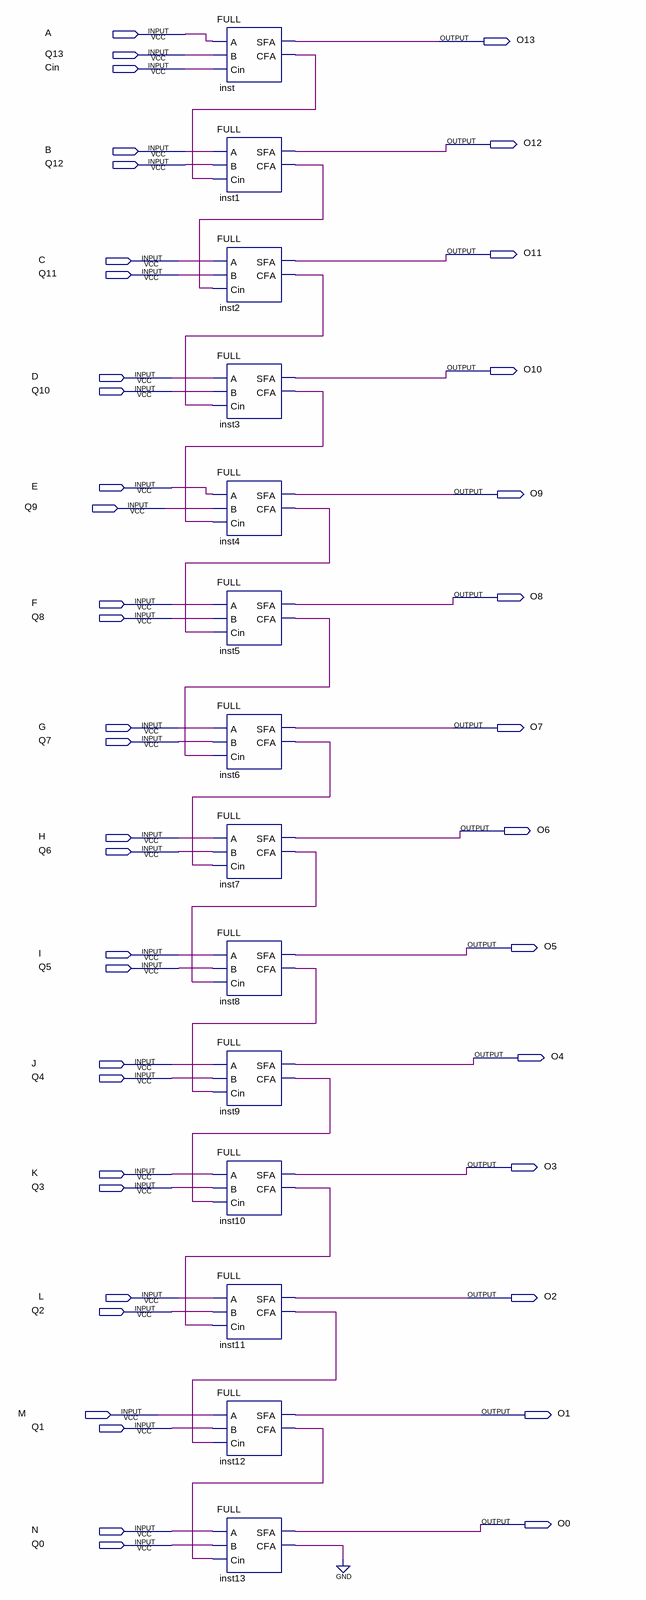
[diagram p0: schematic sheet]
// Quartus schematic RCAFOURTEEN.bdf as structural Verilog: 14 symbols, 43 pins
module RCAFOURTEEN (
  input  A,
  input  Q13,
  input  Cin,
  input  B,
  input  Q12,
  input  C,
  input  Q11,
  input  D,
  input  Q10,
  input  E,
  input  Q9,
  input  F,
  input  Q8,
  input  G,
  input  Q7,
  input  H,
  input  Q6,
  input  I,
  input  Q5,
  input  J,
  input  Q4,
  input  K,
  input  Q3,
  input  L,
  input  Q2,
  input  M,
  input  Q1,
  input  N,
  input  Q0,
  output O13,
  output O12,
  output O11,
  output O10,
  output O9,
  output O8,
  output O7,
  output O6,
  output O5,
  output O4,
  output O3,
  output O2,
  output O1,
  output O0
);

  wire inst1_cfa, inst2_cfa, inst3_cfa, inst4_cfa, inst5_cfa, inst6_cfa, inst7_cfa, inst8_cfa, inst9_cfa,
       inst10_cfa, inst11_cfa, inst12_cfa, inst13_cfa, inst_cfa;

  FULL inst (.A(A), .B(Q13), .Cin(Cin), .SFA(O13), .CFA(inst_cfa));
  FULL inst1 (.A(B), .B(Q12), .Cin(inst_cfa), .SFA(O12), .CFA(inst1_cfa));
  FULL inst2 (.A(C), .B(Q11), .Cin(inst1_cfa), .SFA(O11), .CFA(inst2_cfa));
  FULL inst3 (.A(D), .B(Q10), .Cin(inst2_cfa), .SFA(O10), .CFA(inst3_cfa));
  FULL inst4 (.A(E), .B(Q9), .Cin(inst3_cfa), .SFA(O9), .CFA(inst4_cfa));
  FULL inst5 (.A(F), .B(Q8), .Cin(inst4_cfa), .SFA(O8), .CFA(inst5_cfa));
  FULL inst6 (.A(G), .B(Q7), .Cin(inst5_cfa), .SFA(O7), .CFA(inst6_cfa));
  FULL inst7 (.A(H), .B(Q6), .Cin(inst6_cfa), .SFA(O6), .CFA(inst7_cfa));
  FULL inst8 (.A(I), .B(Q5), .Cin(inst7_cfa), .SFA(O5), .CFA(inst8_cfa));
  FULL inst9 (.A(J), .B(Q4), .Cin(inst8_cfa), .SFA(O4), .CFA(inst9_cfa));
  FULL inst10 (.A(K), .B(Q3), .Cin(inst9_cfa), .SFA(O3), .CFA(inst10_cfa));
  FULL inst11 (.A(L), .B(Q2), .Cin(inst10_cfa), .SFA(O2), .CFA(inst11_cfa));
  FULL inst12 (.A(M), .B(Q1), .Cin(inst11_cfa), .SFA(O1), .CFA(inst12_cfa));
  FULL inst13 (.A(N), .B(Q0), .Cin(inst12_cfa), .SFA(O0), .CFA(inst13_cfa));
  // also tied to GND on the sheet: inst13_cfa
endmodule
